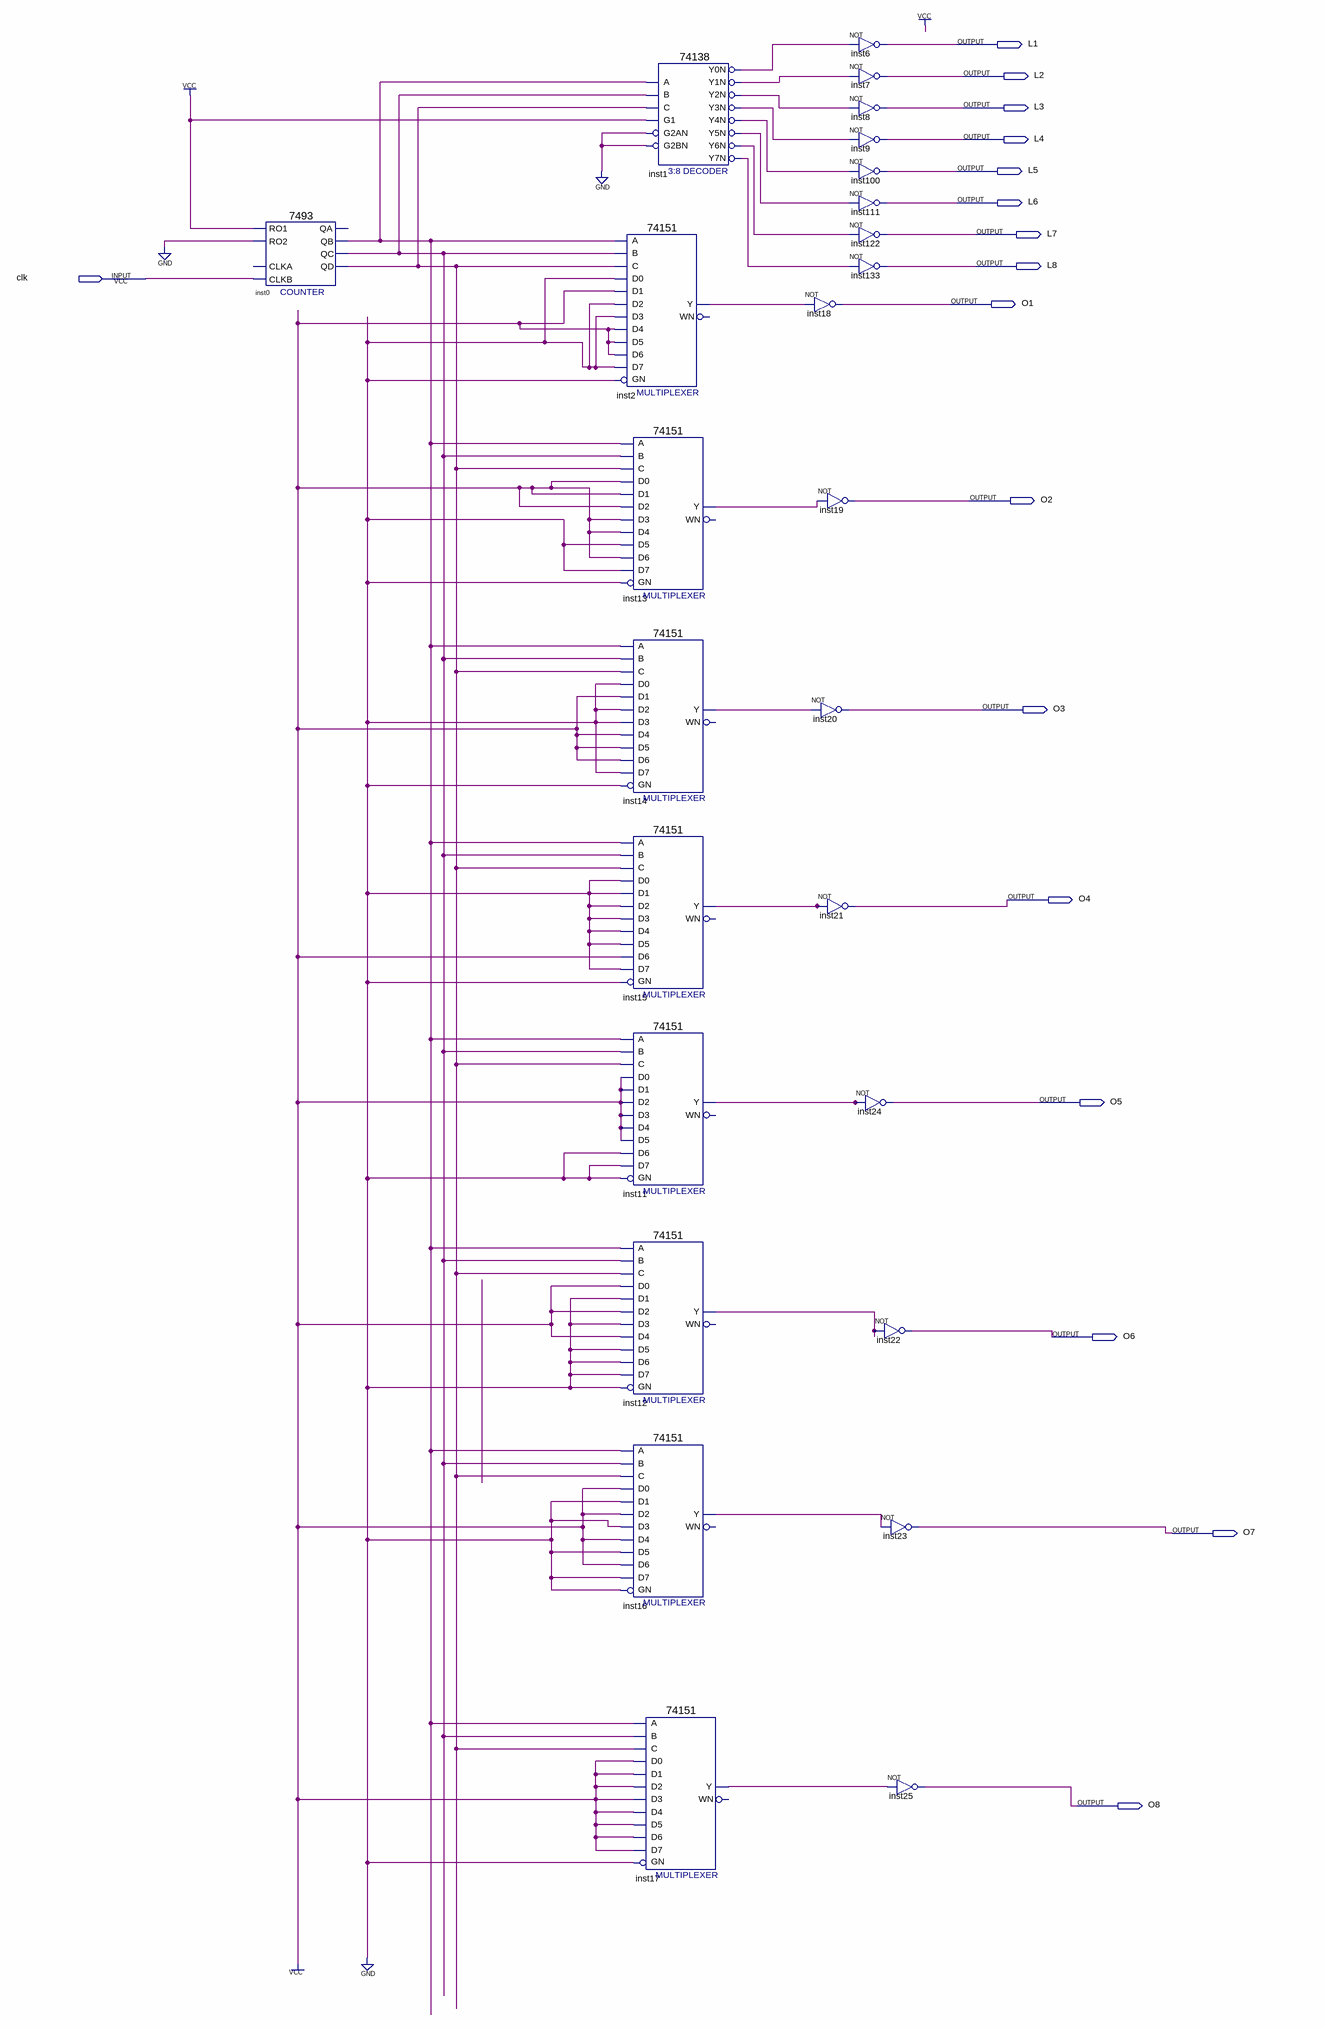
[diagram p0: schematic sheet]
// Quartus schematic test611.bdf as structural Verilog: 26 symbols, 17 pins
module test611 (
  input  clk,
  output L1,
  output L2,
  output L3,
  output L4,
  output L5,
  output L6,
  output L7,
  output L8,
  output O1,
  output O2,
  output O3,
  output O4,
  output O5,
  output O6,
  output O7,
  output O8
);

  wire inst0_qb, inst0_qc, inst0_qd, inst1_y0n, inst1_y1n, inst1_y2n, inst1_y3n, inst1_y4n, inst1_y5n,
       inst1_y6n, inst1_y7n, inst2_y, inst11_y, inst12_y, inst13_y, inst14_y, inst15_y, inst16_y, inst17_y;

  \7493  inst0 (.RO1(1'b1), .RO2(1'b0), .CLKB(clk), .QC(inst0_qc), .QB(inst0_qb), .QD(inst0_qd));  // open: CLKA, QA
  \74151  inst2 (
    .GN(1'b0), .C(inst0_qd), .B(inst0_qc), .A(inst0_qb), .D5(1'b1), .D0(1'b0), .D1(1'b1), .D4(1'b1),
    .D3(1'b0), .D2(1'b0), .D6(1'b1), .D7(1'b0), .Y(inst2_y));  // open: WN
  \74151  inst13 (
    .GN(1'b0), .C(inst0_qd), .B(inst0_qc), .A(inst0_qb), .D5(1'b0), .D0(1'b1), .D1(1'b1), .D4(1'b1),
    .D3(1'b1), .D2(1'b1), .D6(1'b1), .D7(1'b0), .Y(inst13_y));  // open: WN
  \74151  inst14 (
    .GN(1'b0), .C(inst0_qd), .B(inst0_qc), .A(inst0_qb), .D5(1'b1), .D0(1'b0), .D1(1'b1), .D4(1'b1),
    .D3(1'b0), .D2(1'b0), .D6(1'b1), .D7(1'b0), .Y(inst14_y));  // open: WN
  \74151  inst15 (
    .GN(1'b0), .C(inst0_qd), .B(inst0_qc), .A(inst0_qb), .D5(1'b0), .D0(1'b0), .D1(1'b0), .D4(1'b0),
    .D3(1'b0), .D2(1'b0), .D6(1'b1), .D7(1'b0), .Y(inst15_y));  // open: WN
  \74151  inst11 (
    .GN(1'b0), .C(inst0_qd), .B(inst0_qc), .A(inst0_qb), .D5(1'b1), .D0(1'b1), .D1(1'b1), .D4(1'b1),
    .D3(1'b1), .D2(1'b1), .D6(1'b0), .D7(1'b0), .Y(inst11_y));  // open: WN
  \74151  inst12 (
    .GN(1'b0), .C(inst0_qd), .B(inst0_qc), .A(inst0_qb), .D5(1'b0), .D0(1'b1), .D1(1'b0), .D4(1'b1),
    .D3(1'b0), .D2(1'b1), .D6(1'b0), .D7(1'b0), .Y(inst12_y));  // open: WN
  \74151  inst16 (
    .GN(1'b0), .C(inst0_qd), .B(inst0_qc), .A(inst0_qb), .D5(1'b0), .D0(1'b1), .D1(1'b0), .D4(1'b1),
    .D3(1'b0), .D2(1'b1), .D6(1'b1), .D7(1'b0), .Y(inst16_y));  // open: WN
  \74151  inst17 (
    .GN(1'b0), .C(inst0_qd), .B(inst0_qc), .A(inst0_qb), .D5(1'b1), .D0(1'b1), .D1(1'b1), .D4(1'b1),
    .D3(1'b1), .D2(1'b1), .D6(1'b1), .D7(1'b1), .Y(inst17_y));  // open: WN
  \74138  inst1 (
    .A(inst0_qb), .B(inst0_qc), .G1(1'b1), .C(inst0_qd), .G2AN(1'b0), .G2BN(1'b0), .Y0N(inst1_y0n),
    .Y1N(inst1_y1n), .Y2N(inst1_y2n), .Y3N(inst1_y3n), .Y4N(inst1_y4n), .Y5N(inst1_y5n), .Y6N(inst1_y6n),
    .Y7N(inst1_y7n));
  not inst18 (O1, inst2_y);
  not inst19 (O2, inst13_y);
  not inst20 (O3, inst14_y);
  not inst21 (O4, inst15_y);
  not inst6 (L1, inst1_y0n);
  not inst7 (L2, inst1_y1n);
  not inst8 (L3, inst1_y2n);
  not inst9 (L4, inst1_y3n);
  not inst100 (L5, inst1_y4n);
  not inst111 (L6, inst1_y5n);
  not inst122 (L7, inst1_y6n);
  not inst133 (L8, inst1_y7n);
  not inst24 (O5, inst11_y);
  not inst22 (O6, inst12_y);
  not inst23 (O7, inst16_y);
  not inst25 (O8, inst17_y);
endmodule
